# Altium schematic sheet Soldeerbout_P5.SchDoc: Soldeerbout
size A4; DrawnBy: Boghe Tim; Revision: 01; SheetNumber: 5; SheetTotal: 5; Number: PXL2022-0001
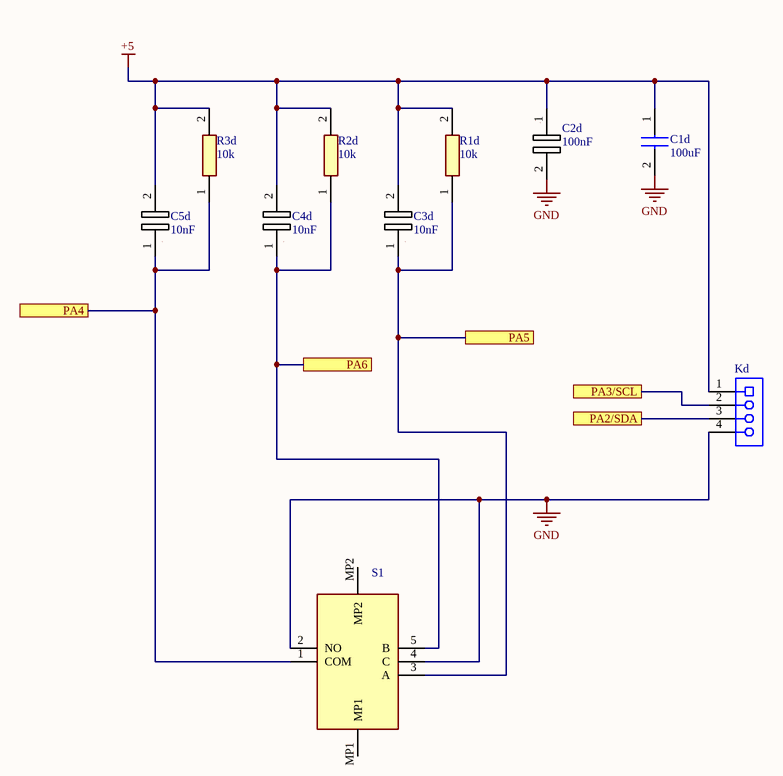
[diagram p0: Soldeerbout_P5.SchDoc]

## Parts
C1d  100uF  [CAPPRD350W52D800H1300]
C2d  100nF  [0805]
C3d  10nF  [0805]
C4d  10nF  [0805]
C5d  10nF  [0805]
Kd  61300411821  [61300411821]  (value not drawn)
R1d  10k  [0805]
R2d  10k  [0805]
R3d  10k  [0805]
S1  482016514001  [482016514001]  (value not drawn)

## Ports
PA2/SDA, PA3/SCL, PA4, PA5, PA6

## Nets
+5: C1d.1(+) C2d.1 C3d.2 C4d.2 C5d.2 Kd.1 R1d.2 R2d.2 R3d.2
GND: C1d.2(-) C2d.2 Kd.4 S1.2(NO) S1.4(C)
PA2/SDA: Kd.3 ; port PA2/SDA
PA3/SCL: Kd.2 ; port PA3/SCL
PA4: C5d.1 R3d.1 S1.1(COM) ; port PA4
PA5: C3d.1 R1d.1 S1.3(A) ; port PA5
PA6: C4d.1 R2d.1 S1.5(B) ; port PA6

Not connected (* = marked no-connect by the designer): S1 MP1 MP2

## Library data of the parts
C1d = 860020674015: Capacitor; Manufacturer_Name: Wurth Elektronik; Datasheet Link: https://www.we-online.com/catalog/datasheet/860020674015.pdf; Height: 13mm; Manufacturer_Part_Number: 860020674015
C2d C3d C4d C5d = ESR10EZPJ183_1: Resistor; Manufacturer_Name: ROHM Semiconductor; Datasheet Link: https://datasheet.datasheetarchive.com/originals/distributors/Datasheets_SAMA/30ccb516c688c96e56c83a00b77a93f4.pdf; Height: 0.65mm; Manufacturer_Part_Number: ESR10EZPJ183
Kd = 61300411821: WR-PHD Socket Header, THT, pitch 2.54mm, Single Row, Vertical, 4p; Manufacturer: Wurth Elektronik; Pin Number: 4; Rated Current: 3A; Working Voltage: 250VAC; Withstanding Voltage: 500VAC; Contact Resistance: 20mOhm; ComponentLink1Description: Manufacturer; ComponentLink1URL: http://www.we-online.de; ComponentLink2Description: Datasheet; ComponentLink2URL: https://www.we-online.com/catalog/datasheet/61300411821.pdf; Manufacturer Part Number: 61300411821; Pitch: 2.54mm; Operating Temperature: -40 to +125degC; Mounting Technology: THT; Packaging: Tray; Gender: Socket Header; Row Number: Single; Orientation: Vertical
R1d R2d R3d = ESR10EZPJ183: Resistor; Manufacturer_Name: ROHM Semiconductor; Datasheet Link: https://datasheet.datasheetarchive.com/originals/distributors/Datasheets_SAMA/30ccb516c688c96e56c83a00b77a93f4.pdf; Height: 0.65mm; Manufacturer_Part_Number: ESR10EZPJ183
S1 = 482016514001: Switch; Manufacturer_Name: Wurth Elektronik; Datasheet Link: https://componentsearchengine.com//482016514001.pdf; Height: 26.9mm; Mouser2 Part Number: 710-482016514001; Mouser2 Price/Stock: https://www.mouser.com/Search/Refine.aspx?Keyword=710-482016514001; Manufacturer_Part_Number: 482016514001